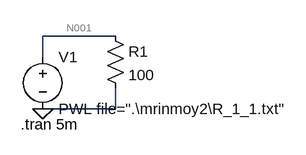
[diagram p0: schematic Draft1.asc]
Draft1.asc, the LTspice schematic file:
Version 4
SHEET 1 1988 680
WIRE 288 32 176 32
WIRE 176 64 176 32
WIRE 288 144 288 112
WIRE 288 144 176 144
FLAG 176 144 0
SYMBOL voltage 176 48 R0
WINDOW 123 0 0 Left 2
WINDOW 39 0 0 Left 2
SYMATTR InstName V1
SYMATTR Value PWL file=".\mrinmoy2\R_1_1.txt"
SYMBOL res 272 16 R0
SYMATTR InstName R1
SYMATTR Value 100
TEXT 142 168 Left 2 !.tran 5m

The netlist it stands for:
* Draft1.asc
V1 N001 0 PWL file=".\mrinmoy2\R_1_1.txt"
R1 N001 0 100
.tran 5m
.backanno
.end

* Results of the author's LTspice run, read from the files saved beside the schematic
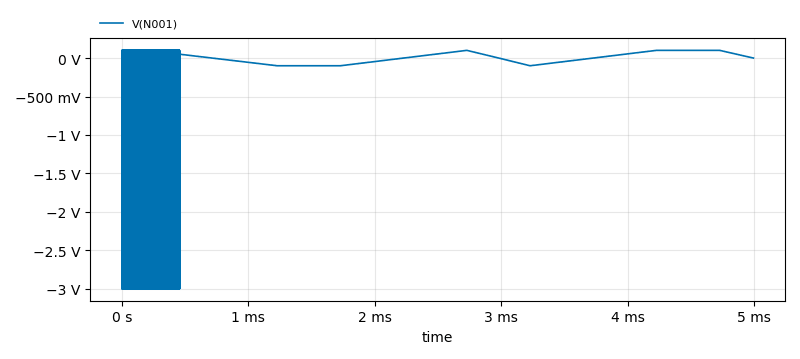
[diagram p1: Transient Analysis of Draft1.asc, plotted from the saved traces]
* Transient Analysis, 1 run:
*   V(N001): min -3 V, max 100 mV, average -128.4 mV, rms 644.2 mV, last 0 V